# EAGLE schematic Main_SMD_Arduino (EAGLE 6.4)
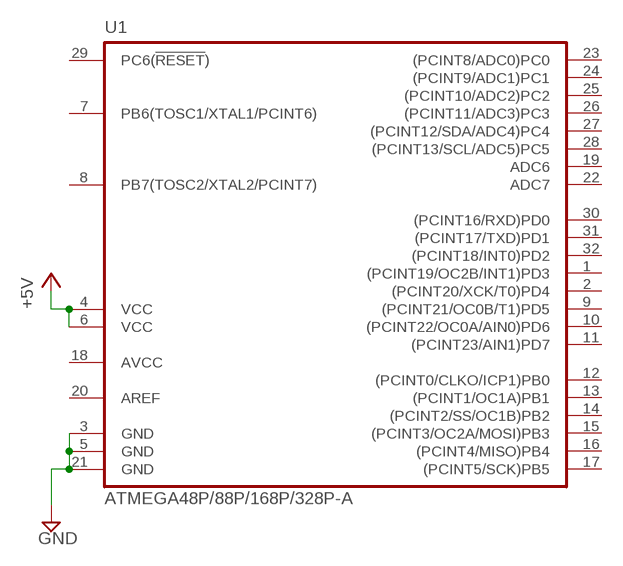
[diagram p0: schematic, sheet 1]

## Parts
U1  ATMEGA48P/88P/168P/328P-A  [TQFP32A]

## Nets
+5V: U1.4(VCC) U1.6(VCC)
GND: U1.3(GND) U1.5(GND) U1.21(GND)
Unconnected: U1.1((PCINT19/OC2B/INT1)PD3) U1.2((PCINT20/XCK/T0)PD4) U1.7(PB6(TOSC1/XTAL1/PCINT6)) U1.8(PB7(TOSC2/XTAL2/PCINT7)) U1.9((PCINT21/OC0B/T1)PD5) U1.10((PCINT22/OC0A/AIN0)PD6) U1.11((PCINT23/AIN1)PD7) U1.12((PCINT0/CLKO/ICP1)PB0) U1.13((PCINT1/OC1A)PB1) U1.14((PCINT2/SS/OC1B)PB2) U1.15((PCINT3/OC2A/MOSI)PB3) U1.16((PCINT4/MISO)PB4) U1.17((PCINT5/SCK)PB5) U1.19(ADC6) U1.20(AREF) U1.22(ADC7) U1.23((PCINT8/ADC0)PC0) U1.24((PCINT9/ADC1)PC1) U1.25((PCINT10/ADC2)PC2) U1.26((PCINT11/ADC3)PC3) U1.27((PCINT12/SDA/ADC4)PC4) U1.28((PCINT13/SCL/ADC5)PC5) U1.29(PC6(!RESET!)) U1.30((PCINT16/RXD)PD0) U1.31((PCINT17/TXD)PD1) U1.32((PCINT18/INT0)PD2)

## Power pins joined to a net without a drawn wire
AVCC: U1.18(AVCC)

## Library data of the parts
U1 = atmel-avr:ATMEGA48P/88P/168P/328P: MICROCONTROLLER 4/8/16/32K Flash